# Altium project 105358-3BA003-01_EFM1_Touch.PrjPCB
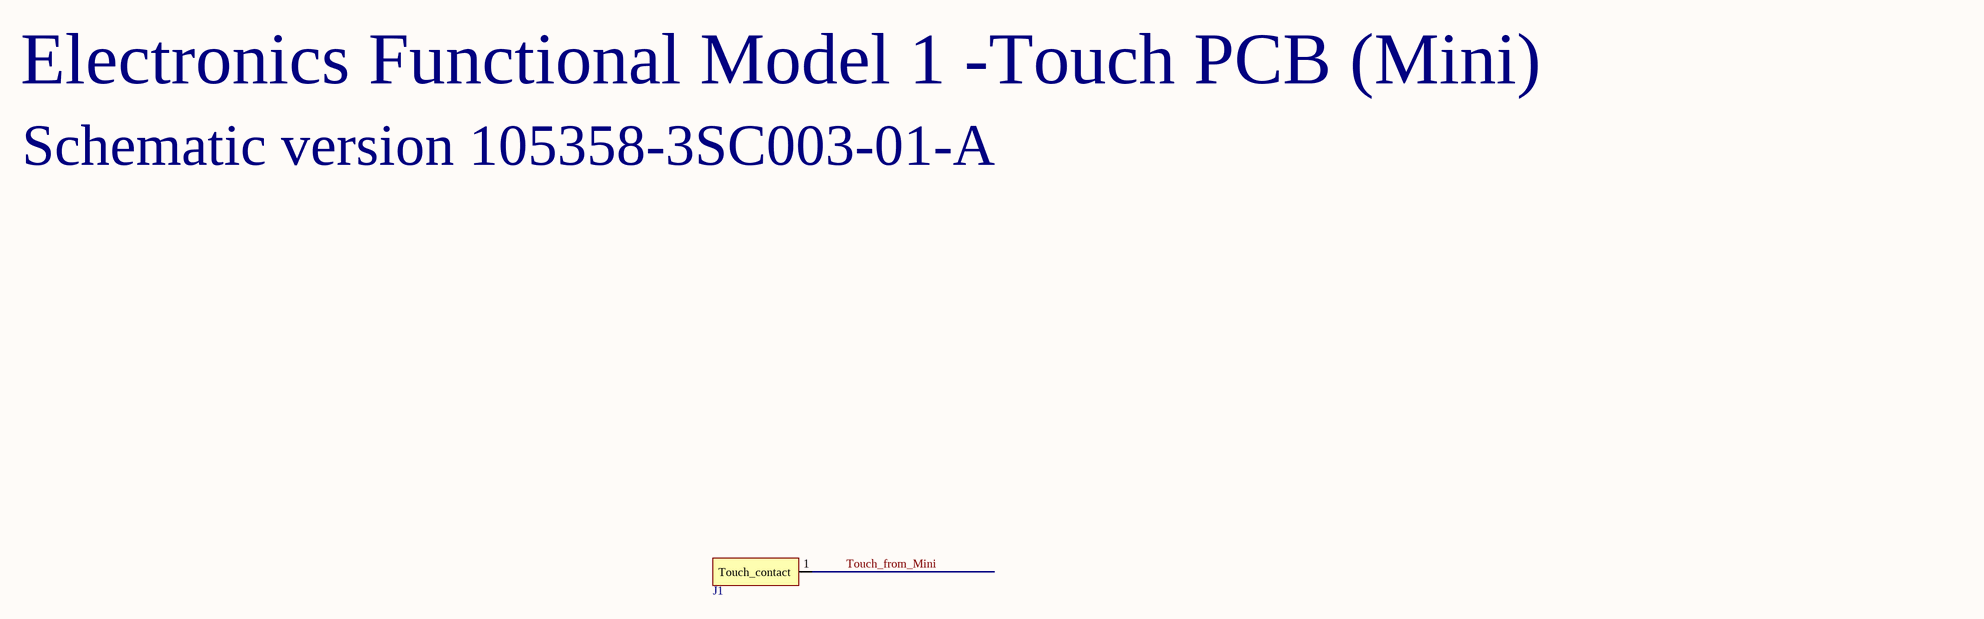
[diagram p0: 105358-3SC003-01-A_Cover-Touch.SchDoc]
PrjVersionControl_RevNumber: ' A '; Project_Board: EFM-Touch Pcb; Project_Customer: Innovation Zed; Project_Document_Number: 105358-3BA003-01-A; Project_Drawn_By: Kartik Karuna; Project_Revision: A; Project_Total_Sheets: X
1 sheet, 1 parts. Net scope: global (net labels, ports and power ports of the same name join across sheets).
Board file: 105358-3LA003-01_EFM1_Touch.PcbDoc

## Sheet 105358-3SC003-01-A_Cover-Touch.SchDoc: Cover- EFM1-Touch
size 420 x 297 mm; DrawnBy: Kartik Karuna; Organization: Hotswap Norden AB; Address1: Knarrarnäsgatan 7; Address2: SE-164 40 Kista; Address3: Sweden; DocumentNumber: 1; SheetNumber: 1; SheetTotal: 1; PageSetup: Record=PageOptions|CenterHorizontal=True|CenterVertical=True|PrintScale=0.98|XCorrection=1.00|YCorrection=1.00|PrintKind=0|BorderSize=5000000|LeftOffset=0|BottomOffset=0|Orientation=2|PaperLength=1000|PaperWidth=1000|Scale=100|PaperSource=7|PrintQuality=-3|MediaType=1|DitherType=10|PrintScaleMode=1|PaperKind=A3|PaperIndex=8

### Parts
J1  COMPONENT_1  [PCBComponent_1]  (value not drawn)  (no BOM)

### Nets
Touch_from_Mini: J1.1(Touch_contact)

### Notes on the sheet
- Electronics Functional Model 1 -Touch PCB (Mini)
- Schematic version 105358-3SC003-01-A
- Title
- Customer, project
- Drawn By
- Board
- Size
- Document Number
- Sheet
- of
- Last modified
- Rev
- Build
- A3